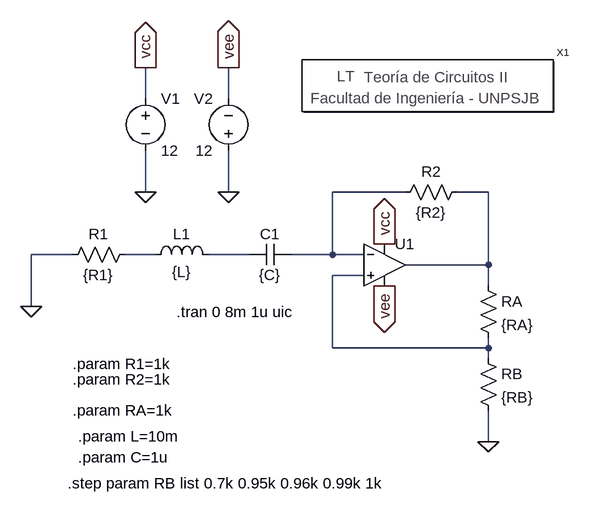
[diagram p0: schematic simulacion_oscilador_res_neg.asc]
simulacion_oscilador_res_neg.asc, the LTspice schematic file:
Version 4
SHEET 1 1012 680
WIRE 80 -320 80 -368
WIRE 208 -320 208 -368
WIRE 80 -176 80 -240
WIRE 208 -176 208 -240
WIRE 480 -176 368 -176
WIRE 608 -176 560 -176
WIRE -32 -80 -96 -80
WIRE 96 -80 48 -80
WIRE 240 -80 176 -80
WIRE 368 -80 368 -176
WIRE 368 -80 304 -80
WIRE 416 -80 368 -80
WIRE 608 -64 608 -176
WIRE 608 -64 480 -64
WIRE 416 -48 368 -48
WIRE 608 -32 608 -64
WIRE -96 0 -96 -80
WIRE 368 64 368 -48
WIRE 608 64 608 48
WIRE 608 64 368 64
WIRE 608 80 608 64
WIRE 608 208 608 160
FLAG 80 -176 0
FLAG 208 -176 0
FLAG 80 -368 vcc
IOPIN 80 -368 Out
FLAG 208 -368 vee
IOPIN 208 -368 Out
FLAG -96 0 0
FLAG 608 208 0
FLAG 448 -96 vcc
IOPIN 448 -96 Out
FLAG 448 -32 vee
IOPIN 448 -32 Out
SYMBOL res 64 -96 R90
WINDOW 0 0 56 VBottom 2
WINDOW 3 32 56 VTop 2
SYMATTR InstName R1
SYMATTR Value {R1}
SYMBOL res 576 -192 R90
WINDOW 0 0 56 VBottom 2
WINDOW 3 32 56 VTop 2
SYMATTR InstName R2
SYMATTR Value {R2}
SYMBOL voltage 80 -336 R0
SYMATTR InstName V1
SYMATTR Value 12
SYMBOL voltage 208 -224 R180
WINDOW 0 24 96 Left 2
WINDOW 3 24 16 Left 2
SYMATTR InstName V2
SYMATTR Value 12
SYMBOL ind 80 -64 R270
WINDOW 0 32 56 VTop 2
WINDOW 3 5 56 VBottom 2
SYMATTR InstName L1
SYMATTR Value {L}
SYMATTR SpiceLine Rser=0
SYMBOL cap 304 -96 R90
WINDOW 0 0 32 VBottom 2
WINDOW 3 32 32 VTop 2
SYMATTR InstName C1
SYMATTR Value {C}
SYMBOL res 592 -48 R0
SYMATTR InstName RA
SYMATTR Value {RA}
SYMBOL res 592 64 R0
SYMATTR InstName RB
SYMATTR Value {RB}
SYMBOL Circuitos2\\Letreros\\Teoría\ de\ Circuitos\ II 512 -336 R0
SYMATTR InstName X1
SYMBOL Opamps\\UniversalOpamp2 448 -64 R0
SYMATTR InstName U1
TEXT -32 88 Left 2 !.param R1=1k
TEXT -32 112 Left 2 !.param R2=1k
TEXT -32 160 Left 2 !.param RA=1k
TEXT -24 200 Left 2 !.param L=10m
TEXT -24 232 Left 2 !.param C=1u
TEXT 128 8 Left 2 !.tran 0 8m 1u uic
TEXT -40 272 Left 2 !.step param RB list 0.7k 0.95k 0.96k 0.99k 1k

The netlist it stands for:
* simulacion_oscilador_res_neg.asc
R1 N003 0 {R1}
R2 N002 N001 {R2}
V1 vcc 0 12
V2 0 vee 12
L1 N003 N004 {L} Rser=0
C1 N001 N004 {C}
RA N002 N005 {RA}
RB N005 0 {RB}
XX1 Teoría de Circuitos II
XU1 N005 N001 vcc vee N002 level.2 Avol=1Meg GBW=10Meg Slew=10Meg ilimit=25m rail=0 Vos=0 phimargin=45 en=0 enk=0 in=0 ink=0 Rin=500Meg  ; pins IN+ IN- V+ V- OUT
.param R1=1k
.param R2=1k
.param RA=1k
.param L=10m
.param C=1u
.tran 0 8m 1u uic
.step param RB list 0.7k 0.95k 0.96k 0.99k 1k
.lib UniversalOpamps2.sub
.backanno
.end